# EAGLE schematic hbridge (EAGLE 9.4.2)
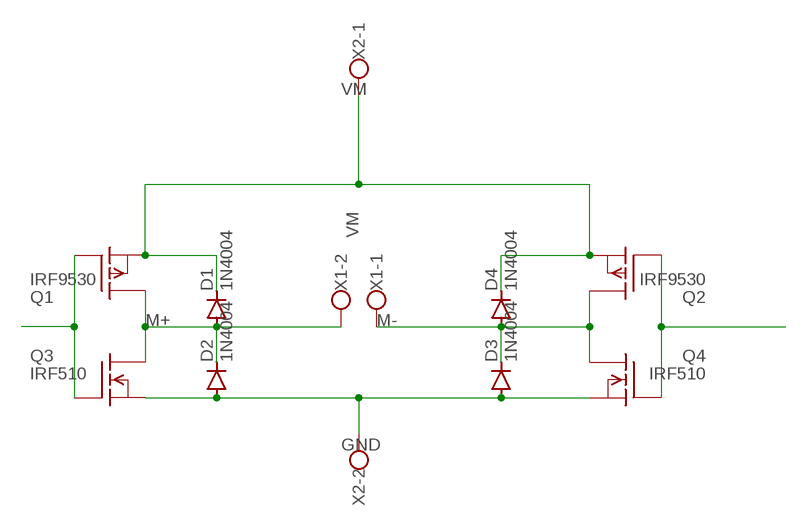
[diagram p0: schematic, sheet 1]

## Parts
D1  1N4004  [DO41-10]
D2  1N4004  [DO41-10]
D3  1N4004  [DO41-10]
D4  1N4004  [DO41-10]
Q1  IRF9530  [TO220]
Q2  IRF9530  [TO220]
Q3  IRF510  [TO220]
Q4  IRF510  [TO220]
X1  W237-102  [W237-102]
X2  W237-102  [W237-102]

## Nets
GND: D2.A D3.A Q3.3(S) Q4.3(S) X2.2
M+: D1.A D2.C Q1.2(D) Q3.2(D) X1.2
M-: D3.C D4.A Q2.2(D) Q4.2(D) X1.1
N$1: Q1.1(G) Q3.1(G)
N$2: Q2.1(G) Q4.1(G)
VM: D1.C D4.C Q1.3(S) Q2.3(S) X2.1

## Library data of the parts
D1-D4 = diode:1N4004: DIODE general purpose rectifier, 1 A
Q1 Q2 = transistor-fet:IRF9530: P-Channel Enhancement MOSFET (HEXFET); -100V; -12A; 0,3Ohm
Q3 Q4 = transistor-fet:IRF510: N-Channel Enhancement MOSFET (HEXFET); 100V; 5,6A; 0,54Ohm
X1 X2 = con-wago-500:W237-102: WAGO SCREW CLAMP; MPN: 237-102; OC_FARNELL: unknown; OC_NEWARK: 70K9898